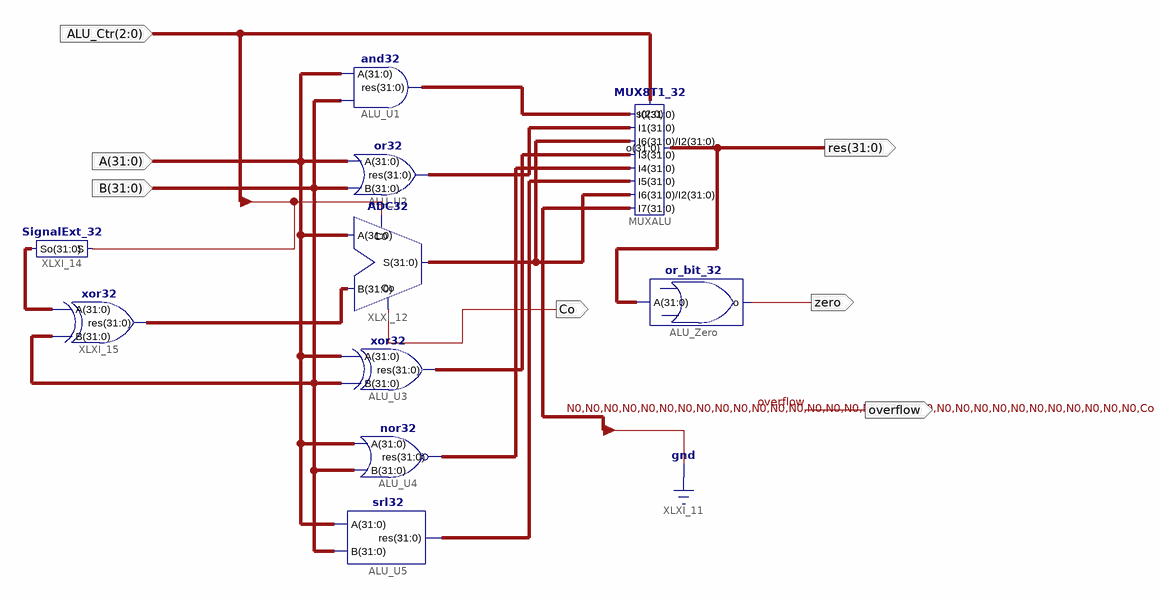
[diagram p0: schematic sheet 1]
// Xilinx ISE schematic alu.sch (kintex7) as structural Verilog: 10 symbols, 7 ports
module alu (
  input  [2:0] ALU_Ctr,
  input  [31:0] A,
  input  [31:0] B,
  output Co,
  output [31:0] res,
  output zero,
  output overflow
);

  wire [31:0] XLXN_21, XLXN_22, XLXN_23, XLXN_24, XLXN_25, XLXN_26, XLXN_27, XLXN_29;

  and32 ALU_U1 (.res(XLXN_21), .A(A), .B(B));
  or32 ALU_U2 (.res(XLXN_22), .A(A), .B(B));
  xor32 ALU_U3 (.A(A), .B(B), .res(XLXN_24));
  nor32 ALU_U4 (.res(XLXN_25), .A(A), .B(B));
  srl32 ALU_U5 (.A(A), .B(B), .res(XLXN_26));
  MUX8T1_32 MUXALU (
    .s(ALU_Ctr), .I7({{31{1'b0}}, Co}), .I6(XLXN_23), .I5(XLXN_26), .I4(XLXN_25), .I3(XLXN_24), .I2(XLXN_23),
    .I1(XLXN_22), .I0(XLXN_21), .o(res));
  or_bit_32 ALU_Zero (.o(zero), .A(res));
  ADC32 XLXI_12 (.B(XLXN_29), .A(A), .C0(ALU_Ctr[2]), .S(XLXN_23), .Co(Co));
  SignalExt_32 XLXI_14 (.So(XLXN_27), .S(ALU_Ctr[2]));
  xor32 XLXI_15 (.A(XLXN_27), .B(B), .res(XLXN_29));
endmodule
